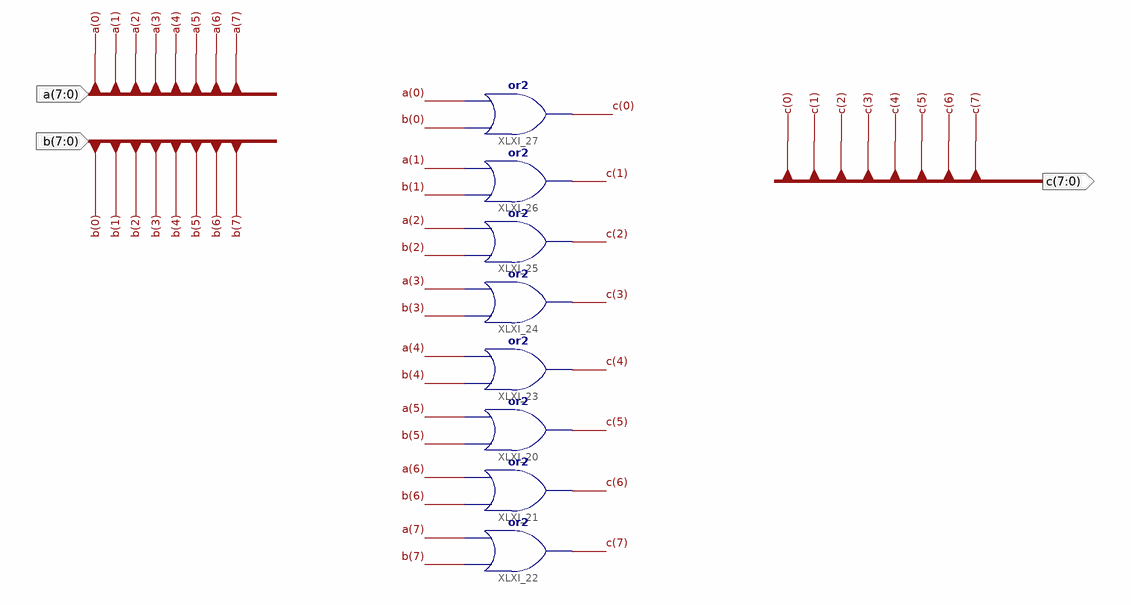
[diagram p0: schematic sheet 1]
// Xilinx ISE schematic eight_bit_or.sch (spartan6) as structural Verilog: 8 symbols, 3 ports
module eight_bit_or (
  input  [7:0] a,
  input  [7:0] b,
  output [7:0] c
);

  or XLXI_20 (c[5], b[5], a[5]);
  or XLXI_21 (c[6], b[6], a[6]);
  or XLXI_22 (c[7], b[7], a[7]);
  or XLXI_23 (c[4], b[4], a[4]);
  or XLXI_24 (c[3], b[3], a[3]);
  or XLXI_25 (c[2], b[2], a[2]);
  or XLXI_26 (c[1], b[1], a[1]);
  or XLXI_27 (c[0], b[0], a[0]);
endmodule
